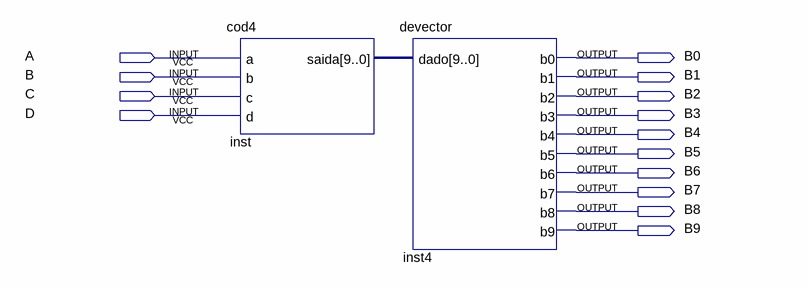
[diagram p0: schematic sheet]
// Quartus schematic Pre2.bdf as structural Verilog: 2 symbols, 14 pins
module Pre2 (
  input  A,
  input  B,
  input  C,
  input  D,
  output B0,
  output B1,
  output B2,
  output B3,
  output B4,
  output B5,
  output B6,
  output B7,
  output B8,
  output B9
);

  wire [9:0] inst_saida;

  cod4 inst (.a(A), .b(B), .c(C), .d(D), .saida(inst_saida));
  devector inst4 (
    .dado(inst_saida), .b0(B0), .b1(B1), .b2(B2), .b3(B3), .b4(B4), .b5(B5), .b6(B6), .b7(B7), .b8(B8),
    .b9(B9));
endmodule
